# Altium schematic sheet Regelaar.SchDoc
size A4; SheetNumber: 5; SheetTotal: 5
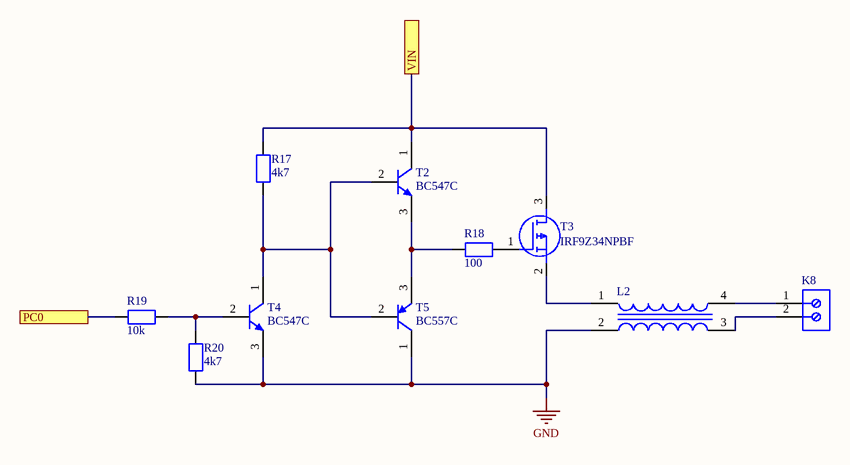
[diagram p0: Regelaar.SchDoc]

## Parts
K8  (no value)  [Shroefconnecter]
L2  (no value)  [Common mode smoorspoel]
R17  4k7  [Resistor]
R18  100  [Resistor]
R19  10k  [Resistor]
R20  4k7  [Resistor]
T2  BC547C  [BC547C]
T3  IRF9Z34NPBF  [MOSFET]
T4  BC547C  [BC547C]
T5  BC557C  [BC557C]

## Ports
PC0 (see CPU[2B]), VIN (see Voeding[3C])

## Nets
GND: L2.2(SEC+) R20.1 T4.3(E) T5.1(C)
PC0: R19.1 ; port PC0
VIN: R17.2 T2.1(C) T3.3(D) ; port VIN
NetK8_1: K8.1 L2.4(PRI-)
NetK8_2: K8.2 L2.3(SEC-)
NetL2_1: L2.1(PRI+) T3.2(S)
NetR17_1: R17.1 T2.2(B) T4.1(C) T5.2(B)
NetR18_1: R18.1 T2.3(E) T5.3(E)
NetR18_2: R18.2 T3.1(G)
NetR19_2: R19.2 R20.2 T4.2(B)

## Library data of the parts
K8 = Schroefconnector: Female Header, Pitch 5 mm, 1 x 2 Position, Height 10 mm, Tail Length 3.5 mm, Rohs, Bulk; Manufacturer: TE Connectivity; Wire Gauge: 16-30AWG; Product Training Modules: Wire-to-BoardEurostyleTerminalBlocks; Clamp Material - Plating: Brass-NickelPlated; Voltage: 300V; Mating Orientation: HorizontalwithBoard; Current: 13.5A; Pitch: 0.197"(5.00mm); Screw Thread: M3; 3D Model: 282836-2.pdf; Other Names: 5ULV-02B / A98076; Dynamic Catalog: BuchananSeries; Number of Levels: 1; Torque - Screw: 0.68Nm(6Lb-In); Featured Product: EurostyleTerminalBlockConnectors; Positions Per Level: 2; Wire Termination: Screw-RisingCageClamp; Datasheet URL: http://www.te.com.cn/commerce/DocumentDelivery/DDEController?Action=showdoc&DocId=Catalog+Section%7F1308389_EUROSTYLE_TERMINAL_BLOCKS%7F0607%7Fpdf%7FEnglish%7FENG_CS_1308389_EUROSTYLE_TERMINAL_BLOCKS_0607.pdf%7F282836-2; Color: Green; Family: TerminalBlocks-WiretoBoard; RoHS Information: 282836-2StatementofCompliance; Standard Package: 300; Contact Material - Plating: Brass-TinPlated; Manufacturer URL: http://www.te.com; Housing Material: Polyamide(PA66),Nylon6/6; Features: Interlocking(Side); Package Description: Female Header, Pitch 5 mm, 1 x 2 Position, Height 10 mm, Tail Length 3.5 mm; Mounting Type: ThroughHole; Package Reference: THD; Packaging: Bulk; Series: Buchanan; Category: Connectors,Interconnects; Screw Material - Plating: Brass-NickelPlated
L2 = Smoorspoel commom mode: Transformer CM2545X171B-10; Manufacturer_Name: Laird Technologies; Datasheet Link: https://datasheet.datasheetarchive.com/originals/dk/DKDS-7/122753.pdf; Height: 9.5mm; Manufacturer_Part_Number: CM2545X171B-10
R17-R20 = Resistor: Manufacturer: Vishay Dale; Part Number: CRCW08050000Z0EA
T2 T4 = BC547C: Amplifier Transistor, NPN Silicon, 3-Pin TO-92, Bulk Box; Manufacturer: On Semiconductor; IC Continuous (A): 0.1; fT Min (MHz): 150; Mounting Technology: Through Hole; ComponentLink1URL: http://www.onsemi.com/; ComponentLink1Description: Manufacturer URL; ComponentLink3URL: http://www.onsemi.cn/pub_link/Collateral/2N6426-D.PDF; DatasheetVersion: Rev. 7; PackageVersion: Rev. AM; Packing: Bulk Box; RoHS: FALSE; Polarity: NPN; PartNumber: BC547C; ComponentLink2URL: http://www.onsemi.com/pub_link/Collateral/BC546-D.PDF; ComponentLink3Description: Package Specification; PackageDescription: 3-Pin Transistor Outline, Body 4.825 x 3.685 mm, Pitch 1.27 mm; PackageReference: TO-92-3-29-11_AM_SL; ComponentLink2Description: Datasheet
T3 = MOSFET: MOSFET (P-Channel); Manufacturer_Name: Infineon; Datasheet Link: https://componentsearchengine.com//IRF9Z34NPBF.pdf; Height: 4.69mm; Mouser2 Part Number: 942-IRF9Z34NPBF; Mouser2 Price/Stock: https://www.mouser.com/Search/Refine.aspx?Keyword=942-IRF9Z34NPBF; Manufacturer_Part_Number: IRF9Z34NPBF
T5 = BC557C: Amplifier Transistor, PNP Silicon, 3-Pin TO-92, Bulk Box; Manufacturer: On Semiconductor; IC Continuous (A): -0.1; Polarity: PNP; PartNumber: BC557C; PackageVersion: Rev. AM; RoHS: FALSE; PackageDescription: 3-Pin Transistor Outline, Body 4.825 x 3.685 mm, Pitch 1.27 mm; Packing: Bulk Box; ComponentLink2Description: Datasheet; DatasheetVersion: Rev. 3; ComponentLink3Description: Package Specification; Mounting Technology: Through Hole; ComponentLink2URL: http://www.onsemi.com/pub_link/Collateral/BC556B-D.PDF; ComponentLink1URL: http://www.onsemi.com/; ComponentLink1Description: Manufacturer URL; ComponentLink3URL: http://www.onsemi.cn/pub_link/Collateral/2N6426-D.PDF; PackageReference: TO-92-3-29-11_AM_SL